# EAGLE design PR9013 (EAGLE 7.2.0)
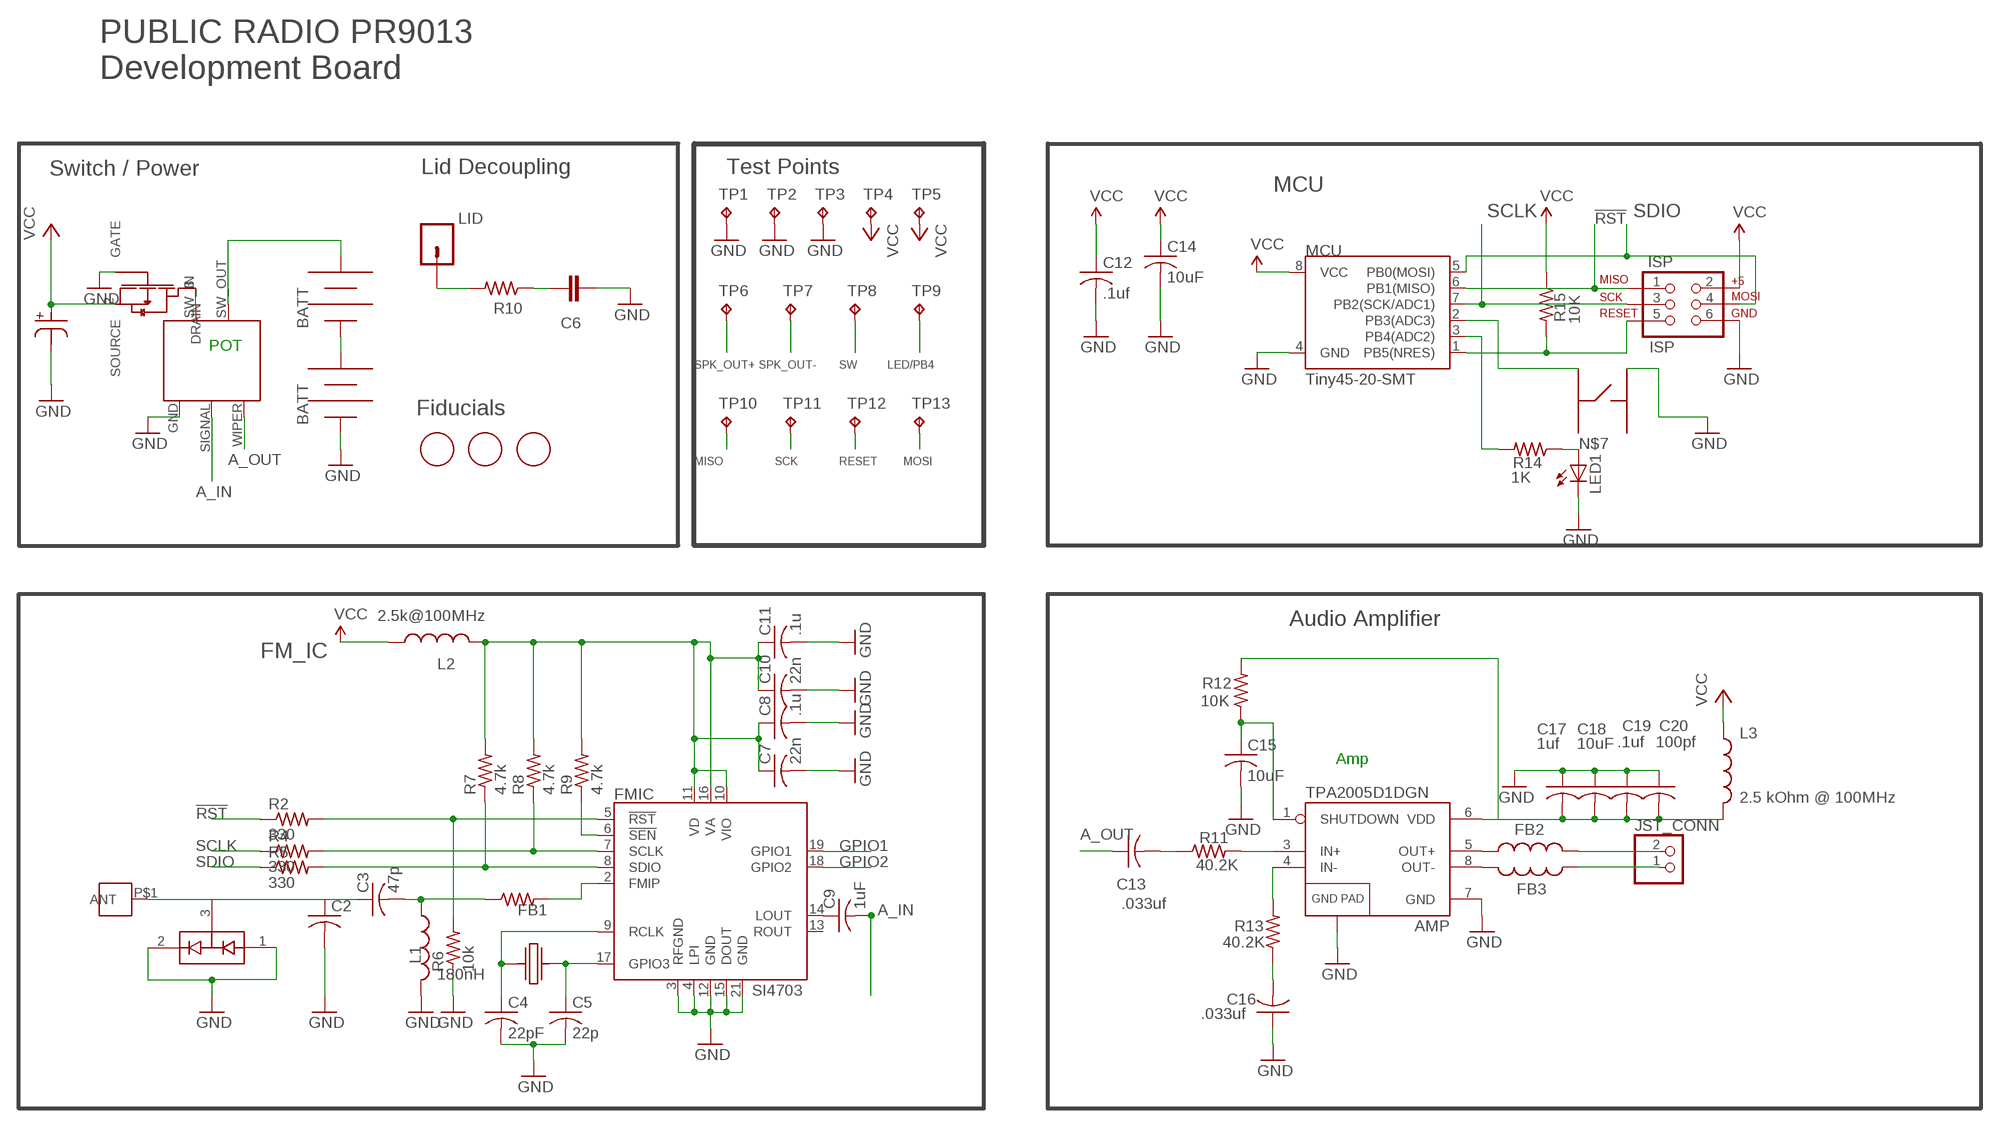
[diagram p0: schematic, sheet 1]

## Parts
AMP  TPA2005D1DGN  [POWER-SOP8]
C1  220uF  NICHICON_SERIESUD  [NICHICON_SERIESUD]
C2  C-USC0402  [C0402]
C3  47p  C-USC0402  [C0402]
C4  22pF  C-USC0402  [C0402]
C5  22p  C-USC0402  [C0402]
C6  CAP0805  [0805]
C7  22n  C-USC0402  [C0402]
C8  .1u  C-USC0402  [C0402]
C9  1uF  C-USC0402  [C0402]
C10  22n  C-USC0402  [C0402]
C11  .1u  C-USC0402  [C0402]
C12  .1uf  C-USC0402  [C0402]
C13  .033uf  C-USC0402  [C0402]
C14  10uF  C-USC0603  [C0603]
C15  10uF  C-USC0603  [C0603]
C16  .033uf  C-USC0402  [C0402]
C17  1uf  C-USC0402  [C0402]
C18  10uF  C-USC0603  [C0603]
C19  .1uf  C-USC0402  [C0402]
C20  100pf  C-USC0402  [C0402]
D1  BAV99  [SOT23]
FB1  R-US_R0402  [R0402]
FB2  INDUCTOR0603  [0603]
FB3  INDUCTOR0603  [0603]
FET1  SI2333DDS  [SI2333DDS]
FMIC  SI4703  SPARKFUN_SI470X  [SPARKFUN_SI470X]
ISP  ISP  AVR_SPI_PRG_6NS  [2X3-NS]
J1  M3_SCREW_POST  [M3_SCREW_POST]
JP5  BK-92_MPD_AA_BATT_CLIP  [BK-92_MPD_AA_BATT_CLIP]
JP6  BK-92_MPD_AA_BATT_CLIP  [BK-92_MPD_AA_BATT_CLIP]
JST_CONN  JST_2PIN-SMT-RA  [JST-PH-2-SMT-RA]
L1  180nH  INDUCTOR0603  [0603]
L2  2.5k@100MHz  INDUCTOR0603  [0603]
L3  2.5 kOhm @ 100MHz  INDUCTOR0603  [0603]
LED1  LEDSML0603  [SML0603]
LID  M01PTH  [1X01]
MCU  Tiny45-20-SMT  ATTINY45TINY85-20-SMT  [SO08-EIAJ]
R1  RV170SF_TAIWANA_POT_SW  [RV170SF_TAIWANA_POT_SW]
R2  330  R-US_R0402  [R0402]
R4  330  R-US_R0402  [R0402]
R5  330  R-US_R0402  [R0402]
R6  10k  R-US_R0402  [R0402]
R7  4.7k  R-US_R0402  [R0402]
R8  4.7k  R-US_R0402  [R0402]
R9  4.7k  R-US_R0402  [R0402]
R10  R-US_R0402  [R0402]
R11  40.2K  R-US_R0402  [R0402]
R12  10K  R-US_R0402  [R0402]
R13  40.2K  R-US_R0402  [R0402]
R14  1K  R-US_R0402  [R0402]
R15  10K  R-US_R0402  [R0402]
TP1  TPTP14R  [TP14R]
TP2  TPTP14R  [TP14R]
TP3  TPTP14R  [TP14R]
TP4  TPTP14R  [TP14R]
TP5  TPTP14R  [TP14R]
TP6  TPTP14R  [TP14R]
TP7  TPTP14R  [TP14R]
TP8  TPTP14R  [TP14R]
TP9  TPTP14R  [TP14R]
TP10  TPTP14R  [TP14R]
TP11  TPTP14R  [TP14R]
TP12  TPTP14R  [TP14R]
TP13  TPTP14R  [TP14R]
U$1  C&KPTS6465  [C&K_TACTILE_SWITCH]
U$3  FIDUCIAL  [FIDUCIAL_1MM]
U$4  FIDUCIAL  [FIDUCIAL_1MM]
U$5  FIDUCIAL  [FIDUCIAL_1MM]
U$6  ABS25XTAL  [ABS25XTAL]

## Nets
3.3V: C7.1 C8.1 C10.1 C11.1 FMIC.10(VIO) FMIC.11(VD) FMIC.16(VA) L2.2 R7.2 R8.2 R9.2
!RST: ISP.1 MCU.6(PB1(MISO)) R2.1 TP10.TP
!RST-L: FMIC.5(!RST) R2.2 R6.2
!SEN-L: FMIC.6(!SEN) R9.1
A_IN: C9.2 R1.SIGNAL
A_OUT: C13.1 R1.WIPER
GND: AMP.7(GND) AMP.9(GND) C1.P$2 C2.2 C4.2 C5.2 C6.2 C7.2 C8.2 C10.2 C11.2 C12.2 C14.2 C15.2 C16.1 C17.1 C18.1 C19.1 C20.1 D1.1(A1) D1.2(C2) FET1.1(GATE) FMIC.3(RFGND) FMIC.4(LPI) FMIC.12(GND) FMIC.15(DOUT) FMIC.21(GND) ISP.6 JP6.NEG JP6.NEG@2(NEG) L1.2 LED1.C MCU.4(GND) R1.GND R6.1 TP1.TP TP2.TP TP3.TP U$1.P$1
GPIO1: FMIC.19(GPIO1)
GPIO2: FMIC.18(GPIO2)
LED/PB4: MCU.3(PB4(ADC2)) R14.2 TP9.TP
N$1: C4.1 FMIC.9(RCLK) U$6.P$4
N$2: C5.1 FMIC.17(GPIO3) U$6.P$1
N$3: C13.2 R11.1
N$4: AMP.3(IN+) R11.2
N$5: AMP.4(IN-) R13.2
N$6: FB1.2 FMIC.2(FMIP)
N$7: LED1.A R14.1
N$8: LID.1 R10.2
N$9: C9.1 FMIC.14(LOUT)
N$13: JP5.NEG JP5.NEG@2(NEG) JP6.POS JP6.POS@2(POS)
N$14 [antenna]: C2.1 C3.1 D1.3(COM) J1.P$1(ANT)
N$15: JP5.POS JP5.POS@2(POS) R1.SW_OUT
N$16 [antenna]: C3.2 FB1.1 L1.1
N$17: AMP.8(OUT-) FB3.2
N$18: AMP.6(VDD) C17.2 C18.2 C19.2 C20.2 L3.2 R12.2
N$19: AMP.5(OUT+) FB2.1
N$20: AMP.1(SHUTDOWN) C15.1 R12.1
N$23: C16.2 R13.1
N$34: FET1.3(DRAIN) R1.SW_IN
N$35: C6.1 R10.1
RESET: ISP.5 MCU.1(PB5(NRES)) R15.2 TP12.TP
SCLK: ISP.3 MCU.7(PB2(SCK/ADC1)) R4.1 TP11.TP
SCLK-L: FMIC.7(SCLK) R4.2 R8.1
SDIO: ISP.4 MCU.5(PB0(MOSI)) R5.1 TP13.TP
SDIO-L: FMIC.8(SDIO) R5.2 R7.1
SPK_OUT+: FB2.2 JST_CONN.2 TP6.TP
SPK_OUT-: FB3.1 JST_CONN.1 TP7.TP
SW: MCU.2(PB3(ADC3)) TP8.TP U$1.P$3
VCC: C1.P$1 C12.1 C14.1 FET1.2(SOURCE) ISP.2 L2.1 L3.1 MCU.8(VCC) R15.1 TP4.TP TP5.TP
Unconnected: FMIC.13(ROUT) U$1.P$2 U$1.P$4

## Notes on the sheet
- PUBLIC RADIO PR9013
  Development Board
- Switch / Power | Lid Decoupling | Test Points
- MCU
- POT
- Fiducials
- MISO | SCK | RESET | MOSI
- Audio Amplifier
- FM_IC
- Amp

## Library data of the parts
AMP = SparkFun-AnalogIC:TPA2005D1: 1.4W MONO CLASS-D AUDIO POWER AMPLIFIER The TPA2005D1 is a 1.4-W high efficiency filter-free class-D audio power amplifier in a BGA, QFN, or MSOP package that requires only three external components. Datasheet: http://focus.ti.com/lit/ds/symlink/tpa2005d1.pdf 1.4 W Into 8 ? From a 5V Supply at THD = 10% (Typ) Maximum Battery Life and Minimum Heat Efficiency With an 8-? Speaker: 84% at 400 mW, 79% at 100 mW 2.8-mA Quiescent Current 0.5-mA Shutdown Current Ideal for Wireless or Cellular Handsets and PDAs Capable of Driving an 8-? Speaker (2.5 V ? VDD ? 5.5 V) and a 4-? Speaker (2.5 V ? VDD ? 4.2 V) Only Three External Components Optimized PWM Output Stage Eliminates LC Output Filter Internally Generated 250-kHz Switching Frequency Eliminates Capacitor and Resistor Improved PSRR (-71 dB at 217 Hz) and Wide Supply Voltage (2.5 V to 5.5 V) Eliminates Need for a Voltage Regulator Fully Differential Design Reduces RF Rectification and Eliminates Bypass Capacitor Improved CMRR Eliminates Two Input Coupling Capacitors
C1 = PR_Parts_Library:NICHICON_SERIESUD: Nichicon UD Series 220uf Cap MFG# UUD1C221MCL1GS
C2-C5 C7-C20 = resistor:C-US: CAPACITOR, American symbol
C6 = SparkFun-Passives:CAP: Capacitor Standard 0603 ceramic capacitor, and 0.1" leaded capacitor.
D1 = SparkFun-DiscreteSemi:BAV99: Two small signal silicon diodes connected anode to cathode. Connections to all three nodes available. DIO-10647; PROD_ID: DIO-10647
FB1 R2 R4-R15 = resistor:R-US_: RESISTOR, American symbol
FB2 FB3 L1-L3 = SparkFun-Passives:INDUCTOR: Inductors Basic Inductor/Choke - 0603 and 1206. Footprints are not proven and vary greatly between part numbers. SRN6045- 33uH, 20% 1.4A SDR0403-560KL - 56uH, 10%, 500mA RMS/740mA peak
FET1 = PubRadioLib:SI2333DDS
FMIC = FM-Meter-Driver-v11:SPARKFUN_SI470X: Description: This is a powerful FM receiver IC. Tested with Si4703. You really only need SEN, RST, SCLK, and SDIO to get a full FM radio working. Antenna comes from headphone jack. See breakout board on SparkFun website for more information.
ISP = SparkFun-Connectors:AVR_SPI_PRG_6: AVR ISP 6 Pin This is the reduced ISP connector for AVR programming. Common on Arduino. This footprint will take up less PCB space and can be used with a 10-pin to 6-pin adapter such as SKU: BOB-08508
J1 = PR_Parts_Library:M3_SCREW_POST
JP5 JP6 = PR_Parts_Library:BK-92_MPD_AA_BATT_CLIP
JST_CONN = adafruit:JST_2PIN: JST 2-Pin Connectors of various flavors SMT-RA (S2B-PH-SM4) 4UConnector #17311 SMT (B2B-PH-SM4) THM-RA (S2B-PH) THM (B2B-PH)
LED1 = led:LED: LED OSRAM: - CHIPLED LG R971, LG N971, LY N971, LG Q971, LY Q971, LO R971, LY R971 LH N974, LH R974 LS Q976, LO Q976, LY Q976 LO Q996 - Hyper CHIPLED LW Q18S LB Q993, LB Q99A, LB R99A - SideLED LS A670, LO A670, LY A670, LG A670, LP A670 LB A673, LV A673, LT A673, LW A673 LH A674 LY A675 LS A676, LA A676, LO A676, LY A676, LW A676 LS A679, LY A679, LG A679 - Hyper Micro SIDELED® LS Y876, LA Y876, LO Y876, LY Y876 LT Y87S - SmartLED LW L88C, LW L88S LB L89C, LB L89S, LG L890 LS L89K, LO L89K, LY L89K LS L896, LA L896, LO L896, LY L896 - TOPLED LS T670, LO T670, LY T670, LG T670, LP T670 LSG T670, LSP T670, LSY T670, LOP T670, LYG T670 LG T671, LOG T671, LSG T671 LB T673, LV T673, LT T673, LW T673 LH T674 LS T676, LA T676, LO T676, LY T676, LB T676, LH T676, LSB T676, LW T676 LB T67C, LV T67C, LT T67C, LS T67K, LO T67K, LY T67K, LW E67C LS E67B, LA E67B, LO E67B, LY E67B, LB E67C, LV E67C, LT E67C LW T67C LS T679, LY T679, LG T679 LS T770, LO T770, LY T770, LG T770, LP T770 LB T773, LV T773, LT T773, LW T773 LH T774 LS E675, LA E675, LY E675, LS T675 LS T776, LA T776, LO T776, LY T776, LB T776 LHGB T686 LT T68C, LB T68C - Hyper Mini TOPLED® LB M676 - Mini TOPLED Santana® LG M470 LS M47K, LO M47K, LY M47K Source: http://www.osram.convergy.de LUXEON: - LUMILED® LXK2-PW12-R00, LXK2-PW12-S00, LXK2-PW14-U00, LXK2-PW14-V00 LXK2-PM12-R00, LXK2-PM12-S00, LXK2-PM14-U00 LXK2-PE12-Q00, LXK2-PE12-R00, LXK2-PE12-S00, LXK2-PE14-T00, LXK2-PE14-U00 LXK2-PB12-K00, LXK2-PB12-L00, LXK2-PB12-M00, LXK2-PB14-N00, LXK2-PB14-P00, LXK2-PB14-Q00 LXK2-PR12-L00, LXK2-PR12-M00, LXK2-PR14-Q00, LXK2-PR14-R00 LXK2-PD12-Q00, LXK2-PD12-R00, LXK2-PD12-S00 LXK2-PH12-R00, LXK2-PH12-S00 LXK2-PL12-P00, LXK2-PL12-Q00, LXK2-PL12-R00 Source: www.luxeon.com KINGBRIGHT: KA-3528ASYC Source: www.kingbright.com
LID = SparkFun-Connectors:M01: Header 1 Standard 1-pin 0.1" header. Use with straight break away headers (SKU : PRT-00116), right angle break away headers (PRT-00553), swiss pins (PRT-00743), machine pins (PRT-00117), and female headers (PRT-00115).
MCU = SparkFun-DigitalIC:ATTINY45: Atmel 8-pin 2/4/8kB flash uC; PROD_ID: IC-09092; VALUE: Tiny85-20-SMT
R1 = PR_Parts_Library:RV170SF_TAIWANA_POT_SW
TP1-TP13 = testpad:TP: Test pad
U$1 = PR_Parts_Library:C&KPTS6465: 6MM Tactile Switch MFG# PTS645SM43SMTR92 LFS
U$3-U$5 = adafruit:FIDUCIAL: For use by pick and place machines to calibrate the vision/machine, 1mm By microbuilder.eu
U$6 = PR_Parts_Library:ABS25XTAL: 4PIN 32.768 Xtal MFG# ABS25-32.768KHZ-T

## Net classes
1 antenna: clearance 1.27 mm

## Board
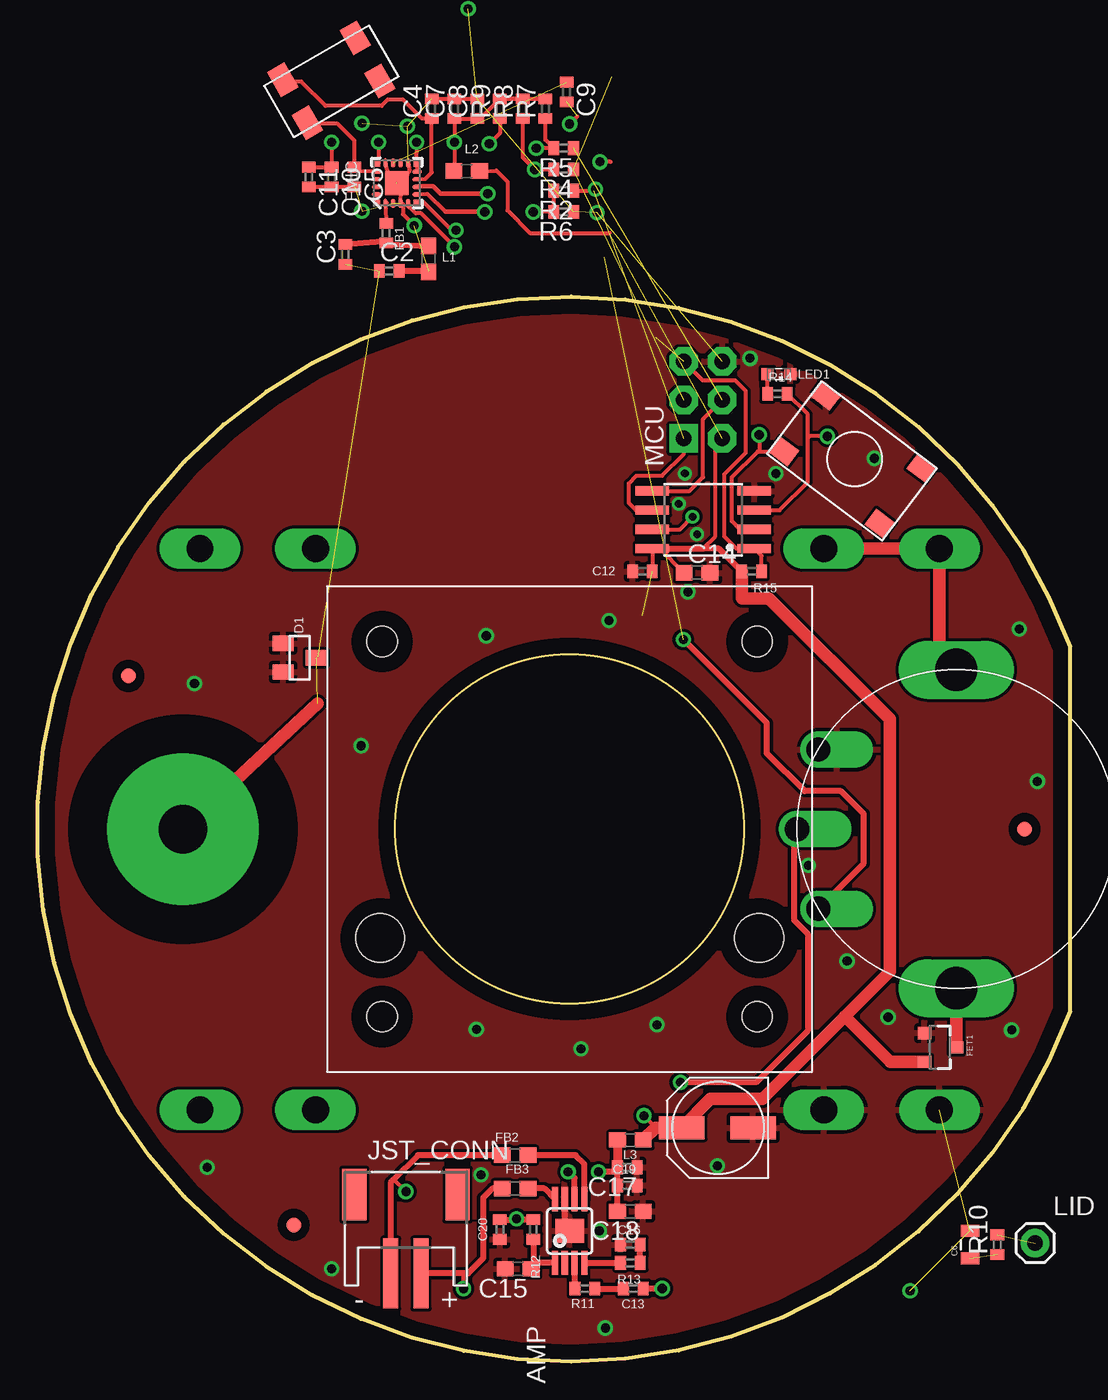
[diagram p1: board, top side]
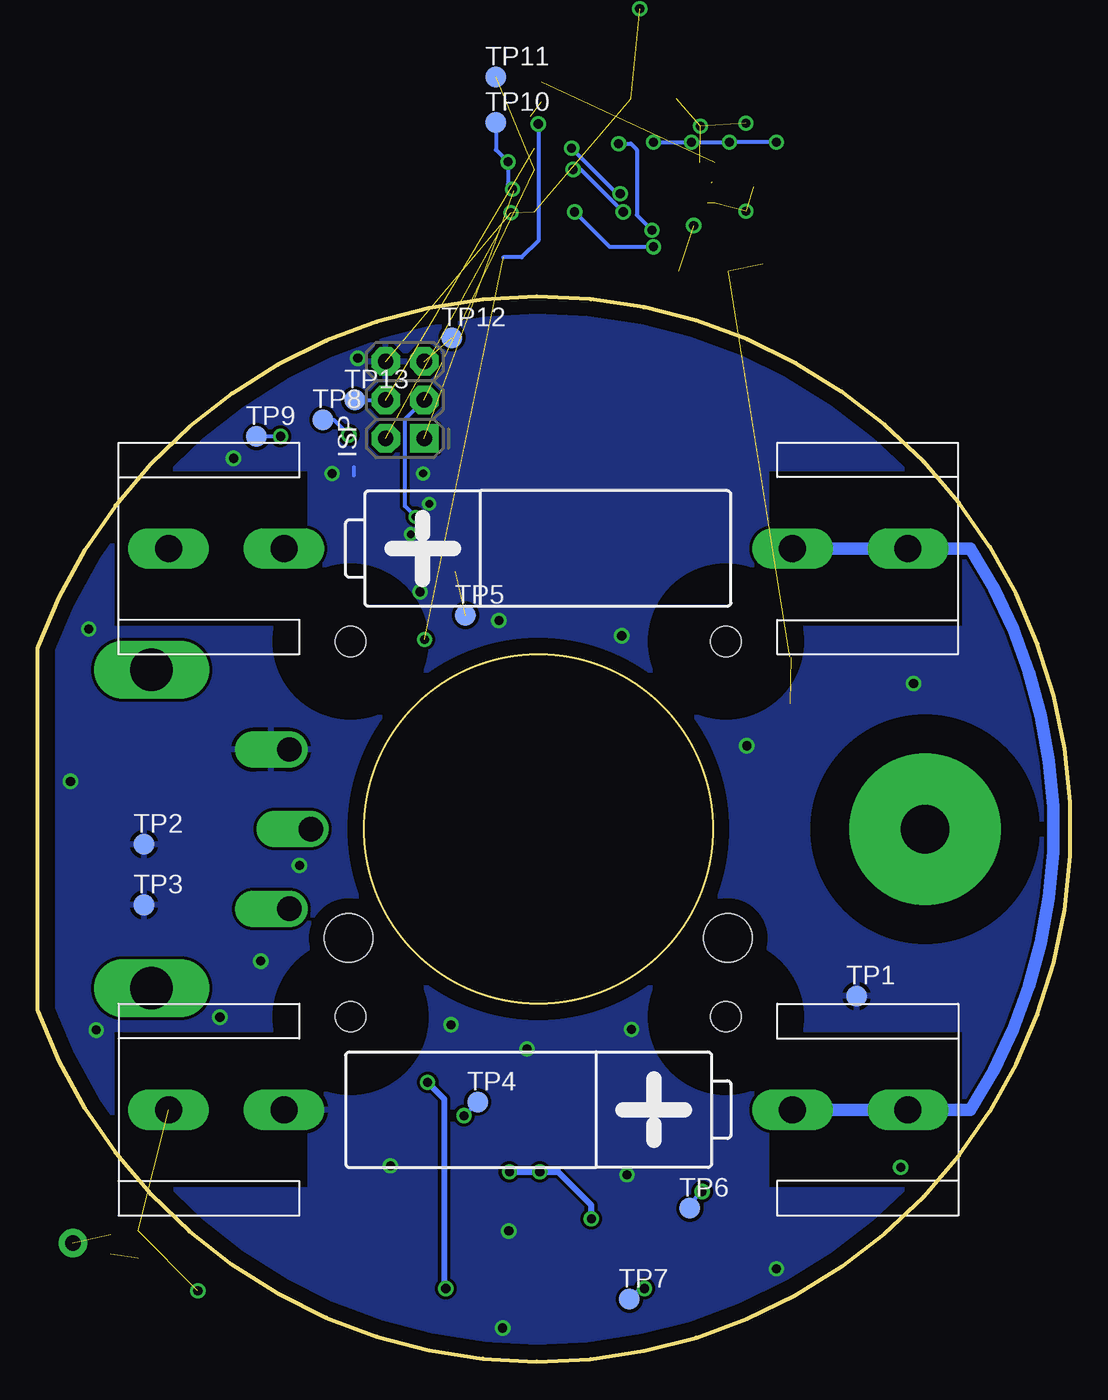
[diagram p2: board, bottom side, seen from below]

Size 68.07 x 70.23 mm. Coordinates in mm from the lower left corner, seen from the top.
Outline: 68.07,23.11 68.07,47.11 arc320 68.07,23.11
Copper layers (1*16): Top 0.035mm / dielectric 1.5mm / Bottom 0.035mm
Design rules "default *": minimum track width 10mil, minimum drill 0.6mm, track to track 8mil, track to pad 8mil, pad to pad 8mil, via to via 8mil, smd to smd 8mil, copper to edge 40mil, drill to drill 8mil, minimum pad ring 10mil, minimum via ring 8mil, stop-mask expansion 4mil, vias tented up to drill 0mil, thermal gap 10mil

### Footprints (pad centres in the part's own frame; a part is rotated, then mirrored left to right if it is on the bottom)
POWER-SOP8 = smd 0.4 x 1.6: 1 -0.975,-2.1; 2 -0.325,-2.1; 3 0.325,-2.1; 4 0.975,-2.1; 5 0.975,2.1; 6 0.325,2.1; 7 -0.325,2.1; 8 -0.975,2.1 | smd 1.89 x 1.57: 9 0,0
NICHICON_SERIESUD = smd 1.5 x 3: P$1 -0.1,2.3; P$2 -0.1,-2.4
C0402 = smd 0.7 x 0.9: 1 -0.65,0; 2 0.65,0
0805 = smd 0.8 x 1.2: 1 -0.9,0; 2 0.9,0
C0603 = smd 1.1 x 1: 1 -0.85,0; 2 0.85,0
SOT23 = smd 1 x 1.4: 1 -0.95,-1.1; 2 0.95,-1.1; 3 0,1.1
R0402 = smd 0.7 x 0.9: 1 -0.65,0; 2 0.65,0
0603 = smd 1.1 x 1: 1 -0.85,0; 2 0.85,0
SI2333DDS = smd 0.8 x 0.9: 1 -0.95,-1; 2 0.95,-1; 3 0,1.1
SPARKFUN_SI470X = smd 0.34 x 0.34: 1 -1.275,1.265; 6 -1.265,-1.265; 11 1.265,-1.265; 16 1.265,1.265 | smd 0.61 x 0.28: 2 -1.335,0.75; 3 -1.335,0.25; 4 -1.335,-0.25; 5 -1.335,-0.75; 12 1.335,-0.75; 13 1.335,-0.25; 14 1.335,0.25; 15 1.335,0.75 | smd 0.28 x 0.61: 7 -0.75,-1.335; 8 -0.25,-1.335; 9 0.25,-1.335; 10 0.75,-1.335; 17 0.75,1.335; 18 0.25,1.335; 19 -0.25,1.335; 20 -0.75,1.335 | smd 1.6 x 1.6: 21 0,0
2X3-NS = drill 1.016 pad 1.88 square: 1 -2.54,-1.27 | drill 1.016 pad 1.88 octagon: 2 -2.54,1.27; 3 0,-1.27; 4 0,1.27; 5 2.54,-1.27; 6 2.54,1.27
M3_SCREW_POST = drill 3.2 pad 10: P$1 0,0
BK-92_MPD_AA_BATT_CLIP = drill 1.778 long: NEG -24.384,0; NEG@2 -16.764,0; POS 16.764,0; POS@2 24.384,0
JST-PH-2-SMT-RA = smd 1 x 4.6: 1 1,-3.7; 2 -1,-3.7 | smd 1.6 x 3.4: NC1 -3.4,1.5; NC2 3.4,1.5
SML0603 = smd 0.8 x 0.8: A 0.75,0; C -0.75,0
1X01 = drill 1.016 pad 1.88: 1 0,0
SO08-EIAJ = smd 0.61 x 2.21: 1 -1.905,-3.378; 2 -0.635,-3.378; 3 0.635,-3.378; 4 1.905,-3.378; 5 1.905,3.353; 6 0.635,3.353; 7 -0.635,3.353; 8 -1.905,3.353
RV170SF_TAIWANA_POT_SW = drill 1.6 offset: GND -5.25,-9.09; SIGNAL 5.25,-9.09; WIPER 0,-10.5 | drill 2.8 long: SW_IN 10.5,0; SW_OUT -10.5,0
CE32A_FOR_JST = hole 2: -12.37,12.37; 12.37,12.37; 12.37,-12.37; -12.37,-12.37 | hole 3.2: -12.497,-7.188; 12.497,-7.188
TP14R = smd 1.4 x 1.4: TP 0,0
C&K_TACTILE_SWITCH = smd 1.55 x 1.3: P$1 -4.026,2.194; P$2 3.874,2.194; P$3 -4.026,-2.406; P$4 3.874,-2.406
FIDUCIAL_1MM = smd 1 x 1: 1 0,0
ABS25XTAL = smd 1.3 x 1.9: P$1 -2.84,-1.74; P$2 2.68,-1.74; P$3 2.68,1.54; P$4 -2.84,1.54

### Placement (x,y rotation side)
AMP  35.07,8.61 0 top
C1  44.77,15.51 90 top
C2  23.17,71.91 0 top
C3  20.27,73.01 90 top
C4  25.97,82.61 90 top  (outside the outline)
C5  20.87,78.11 270 top  (outside the outline)
C6  61.47,7.71 90 top
C7  27.47,82.61 90 top  (outside the outline)
C8  28.97,82.61 90 top  (outside the outline)
C9  34.87,83.71 270 top  (outside the outline)
C10  19.37,78.11 270 top  (outside the outline)
C11  17.87,78.11 270 top  (outside the outline)
C12  39.87,52.11 180 top
C13  39.27,4.81 180 top
C14  43.47,52.01 0 top
C15  31.67,6.11 180 top
C16  39.07,7.71 0 top
C17  38.87,12.81 180 top
C18  39.07,9.91 180 top
C19  38.87,11.61 180 top
C20  30.47,8.71 90 top
D1  17.27,46.41 270 top
FB1  22.97,74.41 90 top  (outside the outline)
FB2  31.47,13.61 180 top
FB3  31.47,11.41 0 top
FET1  59.47,20.71 270 top
FMIC  23.67,77.71 90 top  (outside the outline)
ISP  43.87,63.41 90 bottom
J1  9.57,35.11 0 top
JP5  35.07,53.61 180 bottom
JP6  35.07,16.61 0 bottom
JST_CONN  24.27,9.51 0 top
L1  25.77,72.71 270 top
L2  28.27,78.51 180 top  (outside the outline)
L3  39.07,14.61 180 top
LED1  48.87,65.11 180 top
LID  65.77,7.81 0 top
MCU  43.87,55.51 90 top
R1  60.57,35.11 270 top
R2  34.67,77.21 180 top  (outside the outline)
R4  34.67,78.61 180 top  (outside the outline)
R5  34.67,80.01 180 top  (outside the outline)
R6  34.67,75.81 180 top  (outside the outline)
R7  33.47,82.61 90 top  (outside the outline)
R8  31.97,82.61 90 top  (outside the outline)
R9  30.47,82.61 90 top  (outside the outline)
R10  63.27,7.71 90 top
R11  36.07,4.81 180 top
R12  32.67,8.71 90 top
R13  39.07,6.51 180 top
R14  48.77,63.81 0 top
R15  47.07,52.11 0 top
SPEAKER  CE32A_FOR_JST  [CE32A_FOR_JST]  35.07,35.11 0 top
TP1  14.07,24.11 0 bottom
TP2  61.07,34.11 0 bottom
TP3  61.07,30.11 0 bottom
TP4  39.07,17.11 0 bottom
TP5  39.87,49.21 0 bottom
TP6  25.07,10.11 0 bottom
TP7  29.07,4.11 0 bottom
TP8  49.27,62.11 0 bottom
TP9  53.66,61 0 bottom
TP10  37.87,81.71 0 bottom  (outside the outline)
TP11  37.87,84.71 0 bottom  (outside the outline)
TP12  40.77,67.51 0 bottom
TP13  47.17,63.41 0 bottom
U$1  53.87,59.51 323 top
U$3  16.87,9.01 0 top
U$4  5.97,45.21 0 top
U$5  65.07,35.11 0 top
U$6  19.37,84.61 30 top  (outside the outline)

### Tracks (layer width: path | path; a pad name or v marks a point on that pad's centre or on a via)
3.3V  (via drill 0.6)
  Top 0.254: FMIC.10 25.02,78.57 FMIC.11 25.02,80.36 v24.97,80.41 | v22.47,80.41 22.47,79.04 FMIC.16 | v19.37,80.41 C10.1 C11.1 | R9.2 29.17,81.96 C8.1 C7.1 v27.47,80.41 27.47,78.56 L2.2 | R8.2 R7.2
  Top 0.305: R8.2 R9.2
  Bottom 0.254: v27.47,80.41 v24.97,80.41 v22.47,80.41 v19.37,80.41
!RST  (via drill 0.6)  (1 unrouted)
  Top 0.254: R2.1 36.67,77.21 v36.77,77.31 | 37.77,79.11 v37.07,79.11 | MCU.6 39.43,56.15 38.97,56.61 38.97,57.91 39.47,58.41 41.17,58.41 42.6,59.84 ISP.1
  Bottom 0.254: v36.77,77.31 37.07,77.61 v37.07,79.11 37.87,79.91 TP10.TP
!RST-L  (via drill 0.6)
  Top 0.254: FMIC.5 24.51,76.12 24.92,75.71 25.27,75.71 v27.47,73.51 | R2.2 R6.2 v32.67,75.81
  Bottom 0.254: v32.67,75.81 30.37,73.51 v27.47,73.51
!SEN-L  (via drill 0.6)
  Top 0.254: v29.77,80.31 30.47,81.01 R9.1 | FMIC.6 25.4,76.48 27.27,74.61 v27.57,74.61
  Bottom 0.254: v29.77,80.31 28.97,80.31 28.57,79.91 28.57,75.61 v27.57,74.61
A_IN  (via drill 0.6)  (2 unrouted)
  Top 0.254: 35.57,82.11 v35.07,81.61
  Top 0.406: v42.57,47.61 48.07,42.11 48.07,40.11 50.57,37.61 52.97,37.61 54.47,36.11 54.47,32.85 R1.SIGNAL
  Bottom 0.254: v35.07,81.61 35.07,73.91 36.17,72.81 37.37,72.81
A_OUT  (via drill 0.6)
  Top 0.406: R1.WIPER 49.87,34.91 49.87,29.11 50.77,28.21 50.77,21.81 47.37,18.41 v42.37,18.41 | v41.17,4.81 C13.1
  Bottom 0.406: v42.37,18.41 41.27,17.31 41.27,4.91 v41.17,4.81
GND  (via drill 0.5, 0.6)  (14 unrouted)
  Top 0.254: 24.37,78.31 arc-54 23.77,77.76 23.62,77.76 23.27,78.11 arc-30 FMIC.15 | FMIC.12 24.51,78.5 FMIC.21 23.96,77.26 FMIC.4 24.01,76.37 24.07,76.31 24.07,75.66 v24.82,74.91 | C11.2 C10.2 C5.2 | C4.2 C7.2 C8.2
  Top 0.406: L1.2 25.78,71.91 C2.2 | AMP.7 34.74,8.94 AMP.9
  Bottom 0.254: 47.25,58.95 47.25,58.44
  other vias: 57.52,4.66 43.47,54.56 10.32,44.71 21.32,40.61 64.72,48.31 55.17,59.56 21.37,75.86 37.67,48.86 29.57,47.86 28.38,89.2 65.92,38.26 53.37,26.41 40.82,22.21 37.42,2.21 19.37,6.11 11.17,12.81 28.92,21.91 35.82,20.61 64.22,21.86 50.82,32.71 24.37,81.46 21.37,81.66 42.27,56.56 48.67,58.56 46.97,66.16 37.67,48.86 36.87,75.76 37.02,8.61 29.22,12.31 44.82,12.91 42.87,50.76 56.07,22.71 42.67,58.56
  pour Bottom: 0.07,35.11 arc90 35.07,0.11 arc90 70.07,35.11 arc90 35.07,70.11 arc90
  pour Top: 0.07,35.11 arc90 35.07,0.11 arc90 70.07,35.11 arc90 35.07,70.11 arc90
LED/PB4  (via drill 0.6)
  Top 0.254: MCU.3 48.9,56.15 50.77,58.01 50.77,60.91 | 50.77,60.91 50.77,62.46 R14.2 | v52.07,61.01 50.87,61.01 50.77,60.91
  Bottom 0.254: TP9.TP v52.07,61.01
N$1
  Top 0.254: 25.92,81.81 C4.1 | FMIC.9 25.55,78 25.97,78.41 C4.1 | C4.1 25.32,81.96 24.07,83.21 23.07,83.21 22.67,82.81 18.97,82.81 17.37,84.41 16.25,84.41 U$6.P$4
N$2
  Top 0.254: FMIC.17 21.14,78.5 C5.1 20.87,80.51 19.77,81.61 17.85,81.61 U$6.P$1
N$3
  Top 0.406: R11.1 C13.2
N$4
  Top 0.406: AMP.3 35.39,4.84 R11.2
N$5
  Top 0.406: AMP.4 R13.2
N$6
  Top 0.254: 23.02,76.4 FMIC.2 23.01,75.35 FB1.2
N$7
  Top 0.254: R14.1 LED1.A
N$8  (1 unrouted)
N$9  (1 unrouted)
N$13
  Bottom 0.813: JP6.POS JP6.POS@2 6.57,16.61 arc-66 6.57,53.61 JP5.NEG JP5.NEG@2
N$14  (3 unrouted)
  Top 0.813: J1.P$1 18.43,43.39 | D1.3 18.47,46.46
N$15
  Top 0.813: JP5.POS JP5.POS@2 59.45,46.73 R1.SW_OUT
N$16
  Top 0.406: C3.2 22.69,73.86 FB1.1 23.18,73.7 L1.1
N$17
  Top 0.406: AMP.8 33.39,11.41 FB3.2
N$18  (via drill 0.6)
  Top 0.406: C20.2 31.52,9.36 v31.57,9.41 31.62,9.36 R12.2 | AMP.6 35.39,12.09 v34.97,12.51 | v36.97,12.51 37.92,12.51 C17.2 C19.2 C18.2
  Top 0.61: L3.2 C17.2
  Bottom 0.406: v31.57,9.41 31.57,10.31 33.77,12.51 v34.97,12.51 v36.97,12.51
N$19
  Top 0.406: AMP.5 36.04,13.04 35.47,13.61 FB2.1
N$20
  Top 0.406: AMP.1 32.92,6.51 C15.1 32.67,6.26 R12.1
N$21
  pour Bottom: 
N$23
  Top 0.406: R13.1 C16.2
N$34
  Top 0.813: R1.SW_IN FET1.3
N$35  (1 unrouted)
RESET  (1 unrouted)
  Top 0.254: ISP.5 43.84,64.71 45.97,64.71 46.67,64.01 46.67,59.91 45.27,58.51 45.27,54.41 46.07,53.61 MCU.1 47.72,53.14 R15.2
SCLK  (via drill 0.5)  (2 unrouted)
  Top 0.254: MCU.7 42.33,54.88 v43.17,55.71
  Bottom 0.254: v43.17,55.71 43.87,56.41 43.87,62.14 ISP.3
SCLK-L  (via drill 0.6)
  Top 0.254: R8.1 31.97,79.41 v32.77,78.61 R4.2 | 26.87,75.81 25.69,77 FMIC.7
  Top 0.305: v29.47,75.81 26.87,75.81
  Bottom 0.254: v29.47,75.81 32.27,78.61 v32.77,78.61
SDIO  (1 unrouted)
  Top 0.254: MCU.5 42.97,57.42 43.87,58.31 43.87,62.14 ISP.4
  Bottom 0.254: TP13.TP ISP.4
SDIO-L  (via drill 0.6)
  Top 0.254: v32.87,80.01 R5.2 33.47,80.56 R7.1
  Top 0.305: v29.67,77.01 26.57,77.01 26.07,77.51 25.11,77.51 FMIC.8
  Bottom 0.254: v32.87,80.01 29.87,77.01 v29.67,77.01
SPK_OUT+  (via drill 0.6)
  Top 0.254: v24.27,11.21 23.47,12.01
  Top 0.406: FB2.2 25.07,13.61 23.47,12.01 23.27,11.81 JST_CONN.2
  Bottom 0.254: TP6.TP 25.07,10.41 v24.27,11.21
SPK_OUT-  (via drill 0.6)
  Top 0.254: v28.07,4.81 28.07,5.81
  Top 0.406: FB3.1 29.97,11.41 29.37,10.81 29.37,6.81 28.37,5.81 28.07,5.81 JST_CONN.1
  Bottom 0.254: TP7.TP 28.37,4.81 v28.07,4.81
SW  (via drill 0.6)
  Top 0.254: 49.26,60.16 U$1.P$3 47.57,60.01 | MCU.2 46.3,54.88 45.77,55.41 45.77,58.31 47.47,60.01 47.57,60.01 | v47.57,61.11 47.57,60.01
  Bottom 0.254: TP8.TP 48.57,62.11 v47.57,61.11
VCC  (via drill 0.6)  (2 unrouted)
  Top 0.254: L2.1 30.23,78.55 30.97,77.81 30.97,75.91 32.47,74.41 37.7,74.41 | v39.97,16.21 40.77,15.41 40.97,15.41 | 43.86,53.61 44.67,54.41 44.67,60.4 ISP.2 | C12.1 MCU.8 41.02,53.61 C14.1
  Top 0.406: MCU.8 43.86,53.61 44.92,53.61 R15.1
  Top 0.813: L3.1 40.72,15.41 40.97,15.41 C1.P$1 44.37,17.31 47.77,17.31 53.22,22.76 | 53.22,22.76 56.17,25.71 56.17,42.36 48.22,50.31 46.47,50.31 46.42,50.36 R15.1 | FET1.2 56.22,19.76 53.22,22.76
  Bottom 0.254: TP4.TP v39.97,16.21